# EasyEDA schematic SCH_Power Distribution Board_2022-02-23.json
TITLE: PDB; REV: 1.0; Date: 2022-02-10; Sheet: 1/1; Drawn By: JunnH; Company: Nakuja Project - N2
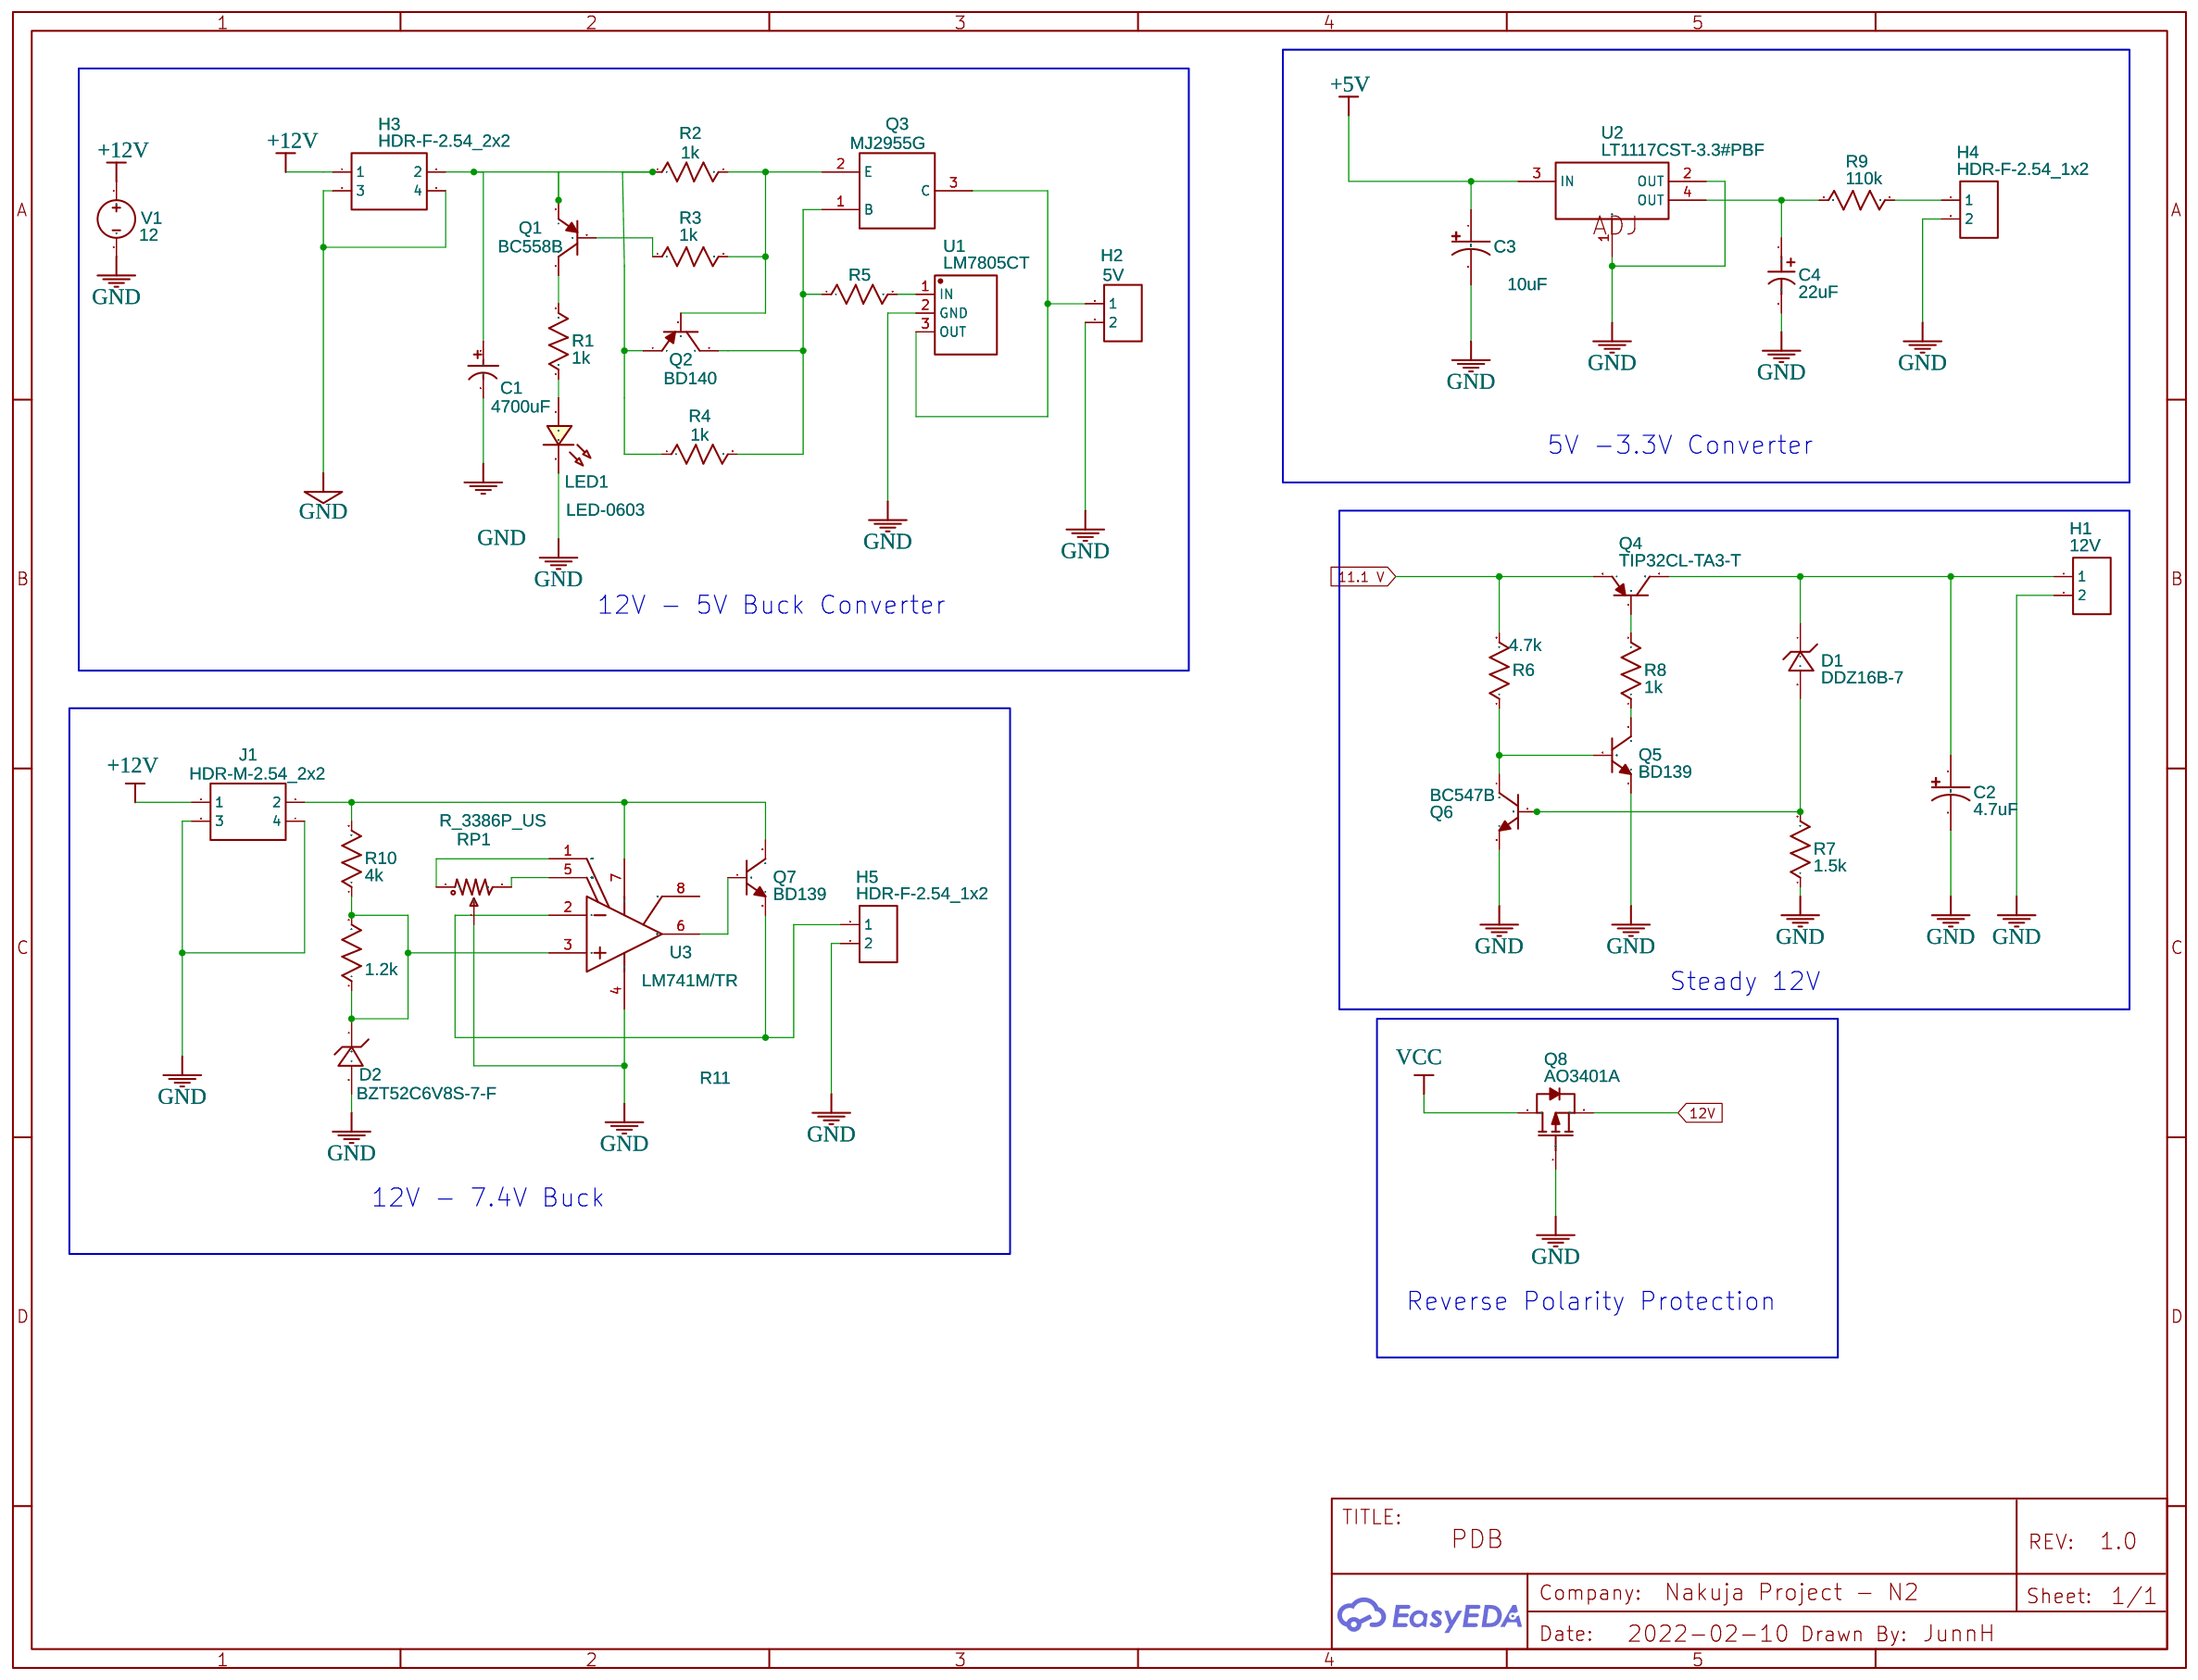
[diagram p0: schematic sheet]

## Parts
C1  4700uF  [CAP-TH_BD16.0-P7.50-D1.2-FD]
C2  4.7uF  [CAP-SMD_BD4.0-L4.3-W4.3-LS5.1-FD]
C3  10uF  [CAP-SMD_BD5.0-L5.3-W5.3-RD]
C4  22uF  [CAP-SMD_BD6.3-L6.6-W6.6-FD]
D1  DDZ16B-7  [SOD-123_L2.8-W1.8-LS3.7-RD]
D2  BZT52C6V8S-7-F  [SOD-323_L1.8-W1.3-LS2.5-RD]
H1  12V  [HDR-F-2.54_1X2]
H2  5V  [HDR-F-2.54_1X2]
H3  HDR-F-2.54_2x2  [HDR-F-2.54_2X2]
H4  HDR-F-2.54_1x2  [HDR-F-2.54_1X2]
H5  HDR-F-2.54_1x2  [HDR-F-2.54_1X2]
J1  HDR-M-2.54_2x2  [HDR-M-2.54_2X2]
LED1  LED-0603  [LED0603_RED]
Q1  BC558B  [TO-92-3_L4.9-W3.7-P1.27-L]
Q2  BD140  [TO-126-3_L8.0-W3.3-P2.28-L]
Q3  MJ2955G  [TO-204_L38.8-W25.5-P10.92-L]
Q4  TIP32CL-TA3-T  [TO-220-3_L10.0-W4.5-P2.54-T]
Q5  BD139  [TO-126-3_L8.0-W3.3-P2.28-L]
Q6  BC547B  [TO-92-3_L4.9-W3.7-P1.27-L]
Q7  BD139  [TO-126_L7.5-W2.5-P2.3-B]
Q8  AO3401A  [SOT-23_L2.9-W1.3-P1.90-LS2.4-BR]
R1  1k  [R0603]
R2  1k  [R0603]
R3  1k  [R0603]
R4  1k  [R0603]
R5  1k  [R0603]
R6  4.7k  [R0603]
R7  1.5k  [R0603]
R8  1k  [R0603]
R9  110k  [R0603]
R10  4k  [R0603]
R11  1.2k  [R0603]
RP1  R_3386P_US  [RES-ADJ-TH_3386P]
U1  LM7805CT  [TO-220-3_L10.0-W4.5-P2.54-L]
U2  LT1117CST-3.3#PBF  [SOT-223-3_L6.5-W3.4-P2.30-LS7.0-BR]
U3  LM741M/TR  [SOP-8_L4.9-W3.9-P1.27-LS6.0-BL]
V1  12  [HDR1X2]

## Library data of the parts
C1 = 4700uF 25V 16*25V: Supplier: LCSC; Manufacturer: ValuePro; Supplier Part: C45070; JLCPCB Part Class: Extended Part
C2 = EEEHP1E4R7R: Supplier: LCSC; Supplier Part: C401861; Manufacturer: PANASONIC; Contributor: LCSC; JLCPCB Part Class: Extended Part
C3 = VE-100M1H0505-TRO: Supplier: LCSC; Supplier Part: C249452; Manufacturer: Lelon; Contributor: LCSC; JLCPCB Part Class: Extended Part
C4 = RVT22UF50V67RV0028: Supplier: LCSC; Supplier Part: C2836438; Manufacturer: KNSCHA(科尼盛); Contributor: LCSC
D1 = DDZ16B-7: Supplier: LCSC; Supplier Part: C459533; Manufacturer: Diodes Incorporated; Contributor: LCSC; JLCPCB Part Class: Extended Part
D2 = BZT52C6V8S-7-F: Supplier: LCSC; Manufacturer: DIODES; Contributor: LCSC; Supplier Part: C124211; JLCPCB Part Class: Extended Part
H1 H2 H4 H5 = HDR-F-2.54_1x2: Supplier Part: C49661; Supplier: LCSC; Contributor: LCEDA_Lib
H3 = HDR-F-2.54_2x2: Supplier Part: C239342; Supplier: LCSC; Contributor: LCEDA_Lib
J1 = HDR-M-2.54_2x2: Supplier Part: C66690; Supplier: LCSC; Contributor: LCEDA_Lib
LED1 = LED-0603_R: Manufacturer: EVERLIGHT(台湾亿光); Manufacturer Part: 19-217/R6C-AL1M2VY/3T; Supplier Part: C72044; Supplier: LCSC; Contributor: LCEDA_01
Q1 = BC558B: Supplier: LCSC; Supplier Part: C713619; Manufacturer: LGE; Contributor: LCSC; JLCPCB Part Class: Extended Part
Q2 = BD14016STU: Supplier: LCSC; Supplier Part: C900680; Manufacturer: ON(安森美); Contributor: LCSC; JLCPCB Part Class: Extended Part
Q3 = MJ2955G: Supplier: LCSC; Supplier Part: C223588; Manufacturer: ON Semicon; Contributor: LCSC; JLCPCB Part Class: Extended Part
Q4 = TIP32CL-TA3-T: Supplier: LCSC; Manufacturer: UTC; Supplier Part: C127015; JLCPCB Part Class: Extended Part
Q5 = BD13916STU: Supplier: LCSC; Supplier Part: C900678; Manufacturer: ON(安森美); Contributor: LCSC; JLCPCB Part Class: Extended Part
Q6 = BC547B: Supplier: LCSC; Supplier Part: C713613; Manufacturer: LGE; Contributor: LCSC; JLCPCB Part Class: Extended Part
Q7 = BD139: Supplier: LCSC; Manufacturer: STMicroelectronics; Supplier Part: C27866; JLCPCB Part Class: Extended Part
Q8 = AO3401A: Supplier: LCSC; Manufacturer: AOS; Supplier Part: C15127; JLCPCB Part Class: Basic Part
R1-R11 = R_0603_US: Contributor: LCEDA_Lib
RP1 = R_3386P_US: Supplier: LCSC; Contributor: LCEDA_Lib; value(Ω): 10K
U1 = LM7805CT: Supplier: LCSC; Manufacturer: FAIRCHILD; Supplier Part: C22146; JLCPCB Part Class: Extended Part
U2 = LT1117CST-3.3#PBF: Supplier: LCSC; Supplier Part: C140395; Manufacturer: Linear Tech; Contributor: LCSC; JLCPCB Part Class: Extended Part
U3 = LM741M/TR: Supplier: LCSC; Supplier Part: C356704; Manufacturer: HGSEMI; Contributor: LCSC; JLCPCB Part Class: Extended Part
V1 = VDC: Contributor: EasyEDA; sim: true

## Nets
12V: Q8.2(S)
+5V: C3.1 U2.3(IN)
+12V: H3.1 J1.1 V1.1
GND: C1.2 C2.2 C3.2 C4.2 D2.2(A) H1.2 H2.2 H3.3 H3.4 H4.2 H5.2 J1.3 J1.4 LED1.2 Q5.1(E) Q6.3(E) Q8.1(G) R7.1 RP1.2 U1.2(GND) U2.1(ADJ) U2.2(OUT) U3.4(V-) V1.2
VCC: Q8.3(D)
11.1 V: Q4.3(E) R6.2
Net-(C1-1): C1.1 H3.2 Q1.3(E) Q2.1(E) R2.1 R4.1
Net-(C2-1): C2.1 D1.1 H1.1 Q4.2(C)
Net-(C4-1): C4.1 R9.1 U2.4(OUT)
Net-(D1-2): D1.2 Q6.2(B) R7.2
Net-(D2-1): D2.1(C) R10.1 R11.1 R11.2 U3.3(IN+)
Net-(H2-1): H2.1 Q3.3(C) U1.3(OUT)
Net-(H4-1): H4.1 R9.2
Net-(H5-1): H5.1 Q7.3(E) U3.2(IN-)
Net-(J1-2): J1.2 Q7.2(C) R10.2 U3.7(V+)
Net-(LED1-1): LED1.1 R1.1
Net-(Q1-1): Q1.1(C) R1.2
Net-(Q1-2): Q1.2(B) R3.1
Net-(Q2-2): Q2.2(C) Q3.1(B) R4.2 R5.1
Net-(Q2-3): Q2.3(B) Q3.2(E) R2.2 R3.2
Net-(Q4-1): Q4.1(B) R8.2
Net-(Q5-2): Q5.2(C) R8.1
Net-(Q5-3): Q5.3(B) Q6.1(C) R6.1
Net-(Q7-1): Q7.1(B) U3.6(OUT)
Net-(R5-2): R5.2 U1.1(IN)
Net-(RP1-1): RP1.1 U3.1(OFFSET_NULL)
Net-(RP1-3): RP1.3 U3.5(OFFSET_NULL)

Not connected (* = marked no-connect by the designer): U3 8(NC)

## Notes on the sheet
- 5V -3.3V Converter
- 12V - 5V Buck Converter
- Steady 12V
- 12V - 7.4V Buck
- Reverse Polarity Protection
